# Altium schematic sheet Controller(1).SchDoc
size A4
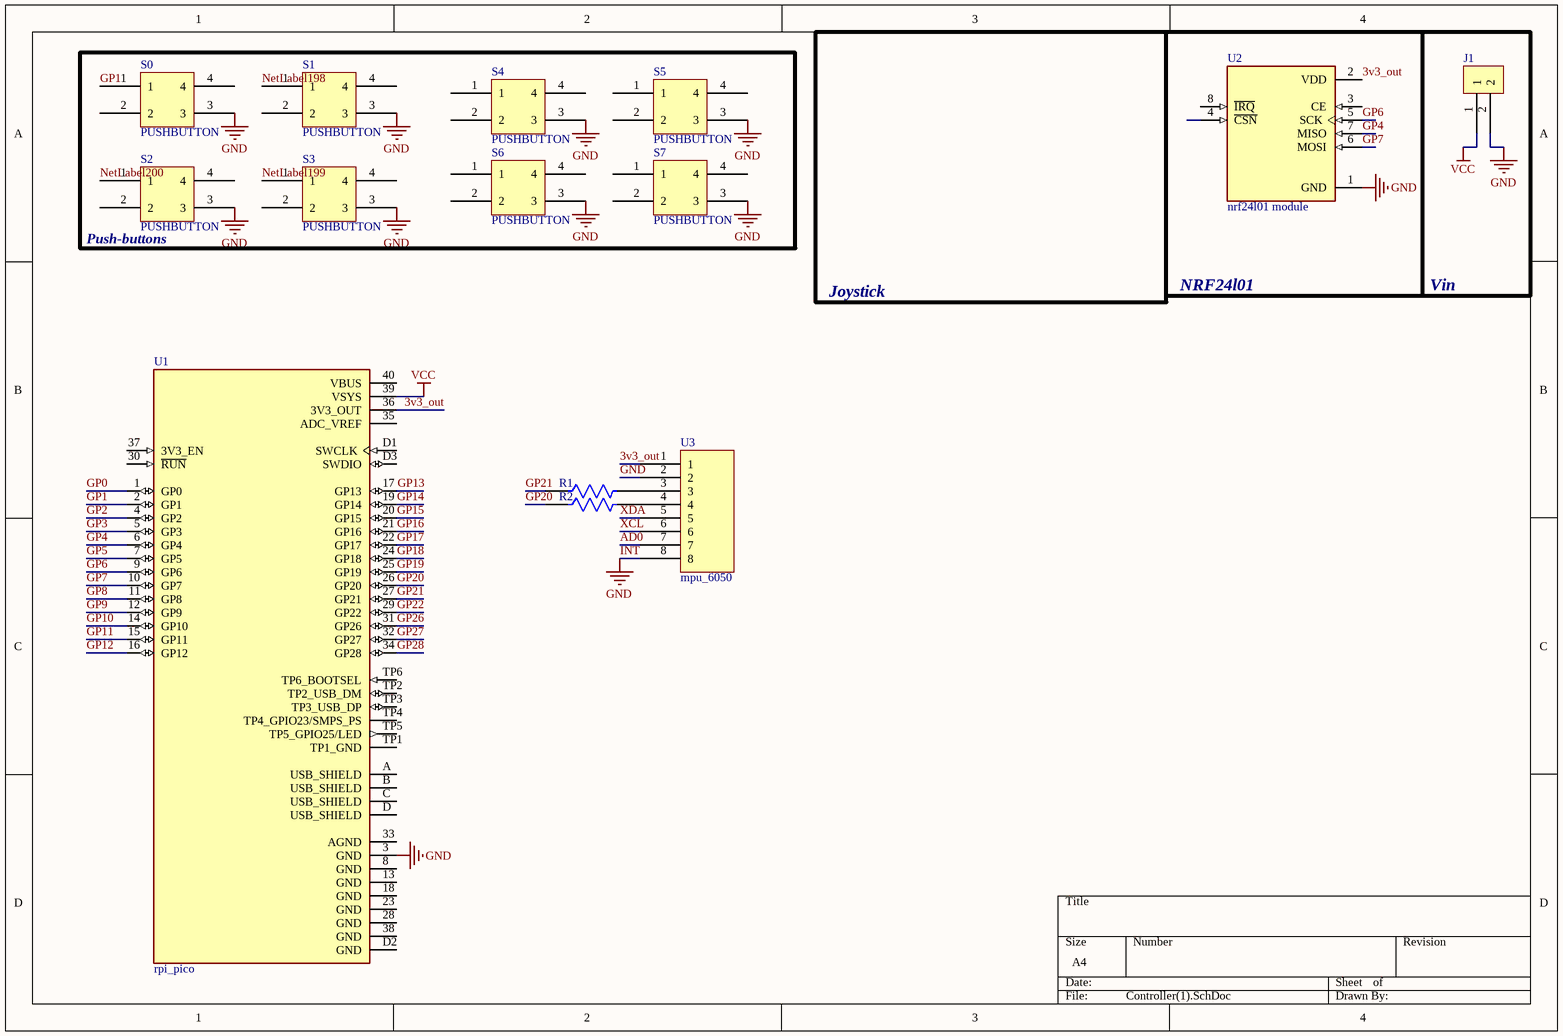
[diagram p0: Controller(1).SchDoc]

## Parts
J1  2pin male header  [2pin]  (value not drawn)
R1  10k ohm resistor  [10k res]  (value not drawn)
R2  10k ohm resistor  [10k res]  (value not drawn)
S0  PUSHBUTTON  [pushbutton - duplicate]
S1  PUSHBUTTON  [pushbutton - duplicate]
S2  PUSHBUTTON  [pushbutton - duplicate]
S3  PUSHBUTTON  [pushbutton - duplicate]
S4  PUSHBUTTON  [pushbutton - duplicate]
S5  PUSHBUTTON  [pushbutton - duplicate]
S6  PUSHBUTTON  [pushbutton - duplicate]
S7  PUSHBUTTON  [pushbutton - duplicate]
U1  rpi_pico  [rpi_pico]
U2  nrf24l01 module  [nrf24l01]
U3  mpu_6050  [mpu_6050 - duplicate1]

## Blocks framed on the sheet
Push-buttons: S0-S7

## Nets
GND: J1.2 S0.3 S1.3 S2.3 S3.3 S4.3 S5.3 S6.3 S7.3 U1.3(GND) U2.1(GND) U3.2 U3.8  [also labelled INT]
VCC: J1.1 U1.39(VSYS)
3v3_out: U1.36(3V3_OUT) U2.2(VDD) U3.1
AD0: U3.7
GP0: U1.1(GP0)
GP1: S0.1 U1.2(GP1)
GP2: U1.4(GP2)
GP3: U1.5(GP3)
GP4: U1.6(GP4) U2.7(MISO)
GP5: U1.7(GP5)
GP6: U1.9(GP6) U2.5(SCK)
GP7: U1.10(GP7) U2.6(MOSI)
GP8: U1.11(GP8)
GP9: U1.12(GP9)
GP10: U1.14(GP10)
GP11: U1.15(GP11)
GP12: U1.16(GP12)
GP13: U1.17(GP13)
GP14: U1.19(GP14)
GP15: U1.20(GP15)
GP16: U1.21(GP16)
GP17: U1.22(GP17)
GP18: U1.24(GP18)
GP19: U1.25(GP19)
GP20: R2.1 U1.26(GP20)
GP21: R1.1 U1.27(GP21)
GP22: U1.29(GP22)
GP26: U1.31(GP26)
GP27: U1.32(GP27)
GP28: U1.34(GP28)
NetLabel198: S1.1
NetLabel199: S3.1
NetLabel200: S2.1
XCL: U3.6
XDA: U3.5
NetR1_2: R1.2 U3.3
NetR2_2: R2.2 U3.4

Not connected (* = marked no-connect by the designer): S0 2 4; S1 2 4; S2 2 4; S3 2 4; S4 1 2 4; S5 1 2 4; S6 1 2 4; S7 1 2 4; U1 8(GND) 13(GND) 18(GND) 23(GND) 28(GND) 30(~{RUN}) 33(AGND) 35(ADC_VREF) 37(3V3_EN) 38(GND) 40(VBUS) A(USB_SHIELD) B(USB_SHIELD) C(USB_SHIELD) D(USB_SHIELD) D1(SWCLK) D2(GND) D3(SWDIO) TP1(TP1_GND) TP2(TP2_USB_DM) TP3(TP3_USB_DP) TP4(TP4_GPIO23/SMPS_PS) TP5(TP5_GPIO25/LED) TP6(TP6_BOOTSEL); U2 3(CE) 4(~{CSN}) 8(~{IRQ})

## Notes on the sheet
- Joystick
- NRF24l01
- Vin

## Library data of the parts
J1 = 2pin
R1 R2 = 10k res
U2 = nrf24l01